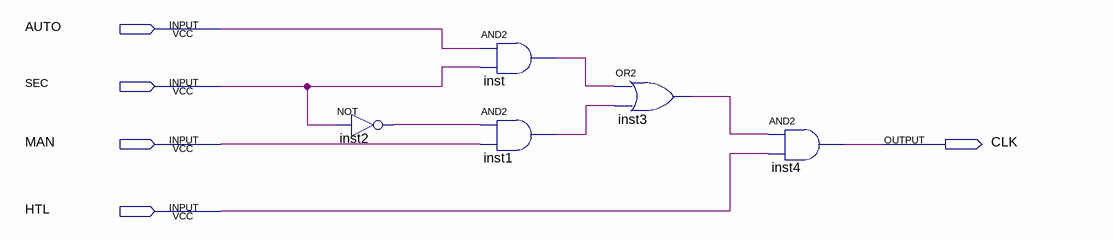
[diagram p0: schematic sheet]
// Quartus schematic Clock_Controller.bdf as structural Verilog: 5 symbols, 5 pins
module Clock_Controller (
  input  AUTO,
  input  SEC,
  input  MAN,
  input  HTL,
  output CLK
);

  wire inst1_out, inst2_out, inst3_out, inst_out;

  not inst2 (inst2_out, SEC);
  and inst (inst_out, AUTO, SEC);
  and inst1 (inst1_out, inst2_out, MAN);
  or inst3 (inst3_out, inst_out, inst1_out);
  and inst4 (CLK, inst3_out, HTL);
endmodule
